# Altium schematic sheet Sheet-RBB.SchDoc
size A; SheetNumber: 1; SheetTotal: 1; SPICEModelCacheORCWZGNP: <root> / <DocumentId>ORCWZGNP</DocumentId> / <CacheFrame Number="0"> / <Model Name="led0" Kind="MDL"> / <Text>*Typ INFRARED GaAs LED: Vf=1.2V Vr=5V If=40mA trr=3uS / *LED Pinout: 1=A, 2=K / .MODEL LED0 D (IS=93.5P RS=84M N=2.63 BV=5 IBV=10U / + CJO=2.97P VJ=.75 M=.333 TT=4.32U)</Text> / </Model> / <Model Name="xtal" Kind="CKT"> / <Text>*Generic type:crystal pkg:HC33/51 / .SUBCKT XTAL 1 2 PARAMS: FREQ=1Meg RS=750 C=13pf Q=1000 / LX 1 3 {((Q*RS)/(6.2831852*FREQ))} IC=0.5M / CX 3 4 {(1/(Q*6.2831852*FREQ*RS))} / C0 1 2 {C} / RS 4 2 {RS} / .ENDS XTAL</Text> / </Model> / </CacheFrame> / </root>
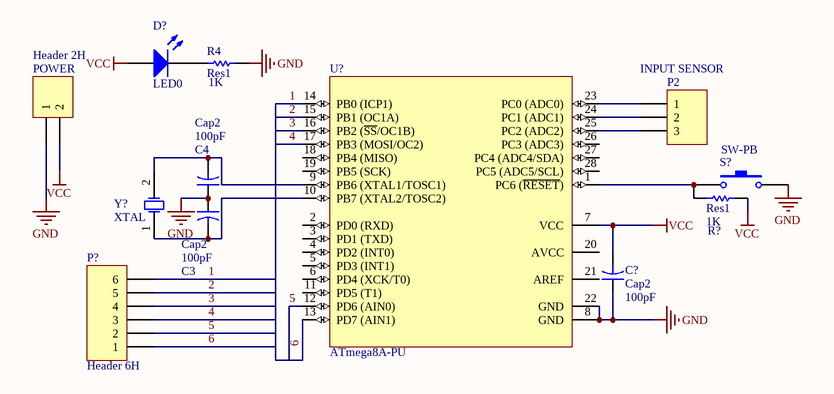
[diagram p0: Sheet-RBB.SchDoc]

## Parts
C3  Cap2  value 100pF  [CAPR5-4X5]
C4  Cap2  value 100pF  [CAPR5-4X5]
C?  Cap2  value 100pF  [CAPR5-4X5]
D?  LED0  [LED-0]
P2  INPUT SENSOR  [HDR1X3]
P?  Header 6H  [HDR1X6H]
POWER  Header 2H  [HDR1X2H]
R4  Res1  value 1K  [AXIAL-0.3]
R?  Res1  value 1K  [AXIAL-0.3]
S?  SW-PB  [SPST-2]
U?  ATmega8A-PU  [28P3]
Y?  XTAL  [R38]

## Nets
GND: C3.1 C4.1 C?.1 POWER.1 R4.2 S?.2 U?.8(GND) U?.22(GND)
VCC: C?.2 D?.1(A) POWER.2 R?.2 U?.7(VCC)
1: P?.6 U?.14(PB0_(ICP1))
2: P?.5 U?.15(PB1_(OC1A))
3: P?.4 U?.16(PB2_(~{SS}/OC1B))
4: P?.3 U?.17(PB3_(MOSI/OC2))
5: P?.2 U?.12(PD6_(AIN0))
6: P?.1 U?.13(PD7_(AIN1))
NetC3_2: C3.2 U?.10(PB7_(XTAL2/TOSC2)) Y?.1(OSC1)
NetC4_2: C4.2 U?.9(PB6_(XTAL1/TOSC1)) Y?.2(OSC2)
NetD?_2: D?.2(K) R4.1
NetP2_1: P2.1 U?.23(PC0_(ADC0))
NetP2_2: P2.2 U?.24(PC1_(ADC1))
NetP2_3: P2.3 U?.25(PC2_(ADC2))
NetR?_1: R?.1 S?.1 U?.1(PC6_(~{RESET}))

Not connected (* = marked no-connect by the designer): U? 2(PD0_(RXD)) 3(PD1_(TXD)) 4(PD2_(INT0)) 5(PD3_(INT1)) 6(PD4_(XCK/T0)) 11(PD5_(T1)) 18(PB4_(MISO)) 19(PB5_(SCK)) 20(AVCC) 21(AREF) 26(PC3_(ADC3)) 27(PC4_(ADC4/SDA)) 28(PC5_(ADC5/SCL))

## Library data of the parts
C3 C4 C? = Cap2: Capacitor; Published: 23-Sep-2002; PackageReference: CAPR5-4X5; Publisher: Altium Limited; PackageDescription: Capacitor; 2 Leads
D? = LED0: Typical INFRARED GaAs LED; Published: 8-Jun-2000; LatestRevisionDate: 08-Jul-2005; LatestRevisionNote: Mech Layer 1 removed.; PackageReference: LED-0; Publisher: Altium Limited; PackageDescription: LED; 2 Leads
P2 = Header 3: Header, 3-Pin; LatestRevisionDate: 17-Jul-2002; LatestRevisionNote: Re-released for DXP Platform.; Publisher: Altium Limited
P? = Header 6H: Header, 6-Pin, Right Angle; LatestRevisionDate: 17-Jul-2002; LatestRevisionNote: Re-released for DXP Platform.; Publisher: Altium Limited
POWER = Header 2H: Header, 2-Pin, Right Angle; LatestRevisionDate: 17-Jul-2002; LatestRevisionNote: Re-released for DXP Platform.; Publisher: Altium Limited
R4 R? = Res1: Resistor; Published: 8-Jun-2000; LatestRevisionDate: 17-Jul-2002; LatestRevisionNote: Re-released for DXP Platform.; PackageReference: AXIAL-0.3; Publisher: Altium Limited; PackageDescription: Axial Device, Thru-Hole; 2 Leads; 0.3 in Pin Spacing
S? = SW-PB: Switch; Published: 24-Mar-1999; LatestRevisionDate: 17-Jul-2002; LatestRevisionNote: Re-released for DXP Platform.; PackageReference: SPST-2; Publisher: Altium Limited; PackageDescription: Switch; 2 Leads
U? = ATmega8A-PU: 8-bit AVR Microcontroller, 2.7-5.5V, 16MHz, 8KB Flash, 512 Bytes EEPROM, 1KB SRAM, 28-pin PDIP, Industrial Grade (-40°C to 85°C); DatasheetVersion: revD, Feb-2011; PackageVersion: revB, Sep-2001; PackageReference: 28P3; PackageDescription: 28-lead (0.300"/7.62mm Wide) Plastic Dual Inline Package (PDIP); ComponentLink1Description: Manufacturer URL; ComponentLink1URL: http://www.atmel.com/; ComponentLink2Description: ATmega8A Datasheet; ComponentLink2URL: http://www.atmel.com/dyn/resources/prod_documents/doc8159.pdf; ComponentLink3Description: ATmega8A Summary; ComponentLink3URL: http://www.atmel.com/dyn/resources/prod_documents/8159S.pdf
Y? = XTAL: Crystal Oscillator; Published: 8-Jun-2000; LatestRevisionDate: 17-Jul-2002; LatestRevisionNote: Re-released for DXP Platform.; PackageReference: R38; Publisher: Altium Limited; PackageDescription: Crystal, Thru-Hole; 2 Leads; Body 3.1 x 8.2 mm (Dia.xH)